# EAGLE design receiver (EAGLE 6.5.0)
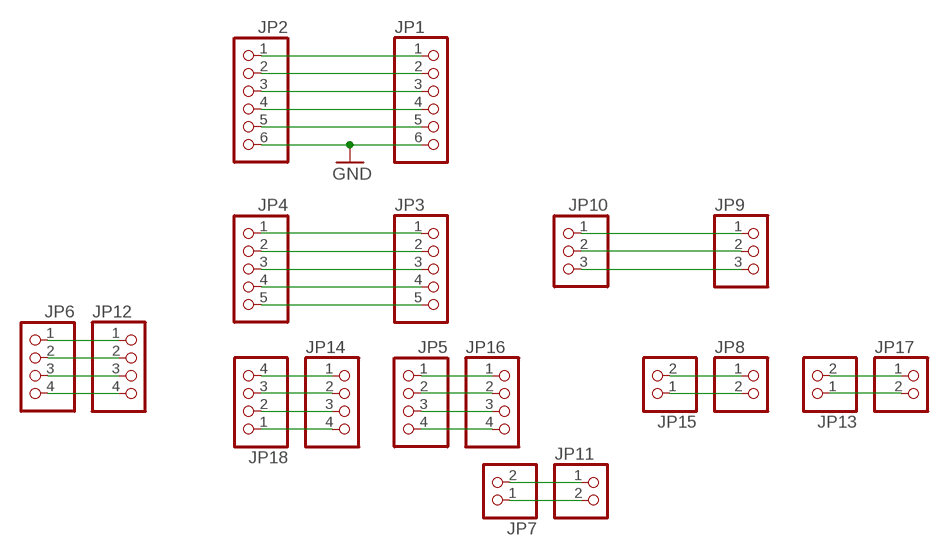
[diagram p0: schematic, sheet 1]

## Parts
JP1  PINHD-1X6  [1X06]
JP2  PINHD-1X6  [1X06]
JP3  PINHD-1X5  [1X05]
JP4  PINHD-1X5  [1X05]
JP5  PINHD-1X4  [1X04]
JP6  PINHD-1X4  [1X04]
JP7  PINHD-1X2  [1X02]
JP8  PINHD-1X2  [1X02]
JP9  PINHD-1X3  [1X03]
JP10  PINHD-1X3  [1X03]
JP11  PINHD-1X2  [1X02]
JP12  PINHD-1X4  [1X04]
JP13  PINHD-1X2  [1X02]
JP14  PINHD-1X4  [1X04]
JP15  PINHD-1X2  [1X02]
JP16  PINHD-1X4  [1X04]
JP17  PINHD-1X2  [1X02]
JP18  PINHD-1X4  [1X04]

## Nets
GND: JP1.6 JP2.6
N$1: JP1.1 JP2.1
N$2: JP1.2 JP2.2
N$3: JP1.3 JP2.3
N$4: JP1.4 JP2.4
N$5: JP1.5 JP2.5
N$6: JP8.1 JP15.2
N$7: JP3.1 JP4.1
N$8: JP3.2 JP4.2
N$9: JP3.3 JP4.3
N$10: JP3.4 JP4.4
N$11: JP3.5 JP4.5
N$12: JP8.2 JP15.1
N$13: JP7.2 JP11.1
N$14: JP7.1 JP11.2
N$15: JP6.1 JP12.1
N$16: JP6.2 JP12.2
N$17: JP6.3 JP12.3
N$18: JP6.4 JP12.4
N$19: JP5.1 JP16.1
N$20: JP9.1 JP10.1
N$21: JP9.2 JP10.2
N$22: JP9.3 JP10.3
N$23: JP5.2 JP16.2
N$24: JP5.3 JP16.3
N$25: JP5.4 JP16.4
N$26: JP14.1 JP18.4
N$27: JP14.2 JP18.3
N$28: JP14.3 JP18.2
N$29: JP14.4 JP18.1
N$30: JP13.2 JP17.1
N$31: JP13.1 JP17.2

## Library data of the parts
JP1 JP2 = pinhead:PINHD-1X6: PIN HEADER
JP3 JP4 = pinhead:PINHD-1X5: PIN HEADER
JP5 JP6 JP12 JP14 JP16 JP18 = pinhead:PINHD-1X4: PIN HEADER
JP7 JP8 JP11 JP13 JP15 JP17 = pinhead:PINHD-1X2: PIN HEADER
JP9 JP10 = pinhead:PINHD-1X3: PIN HEADER

## Board
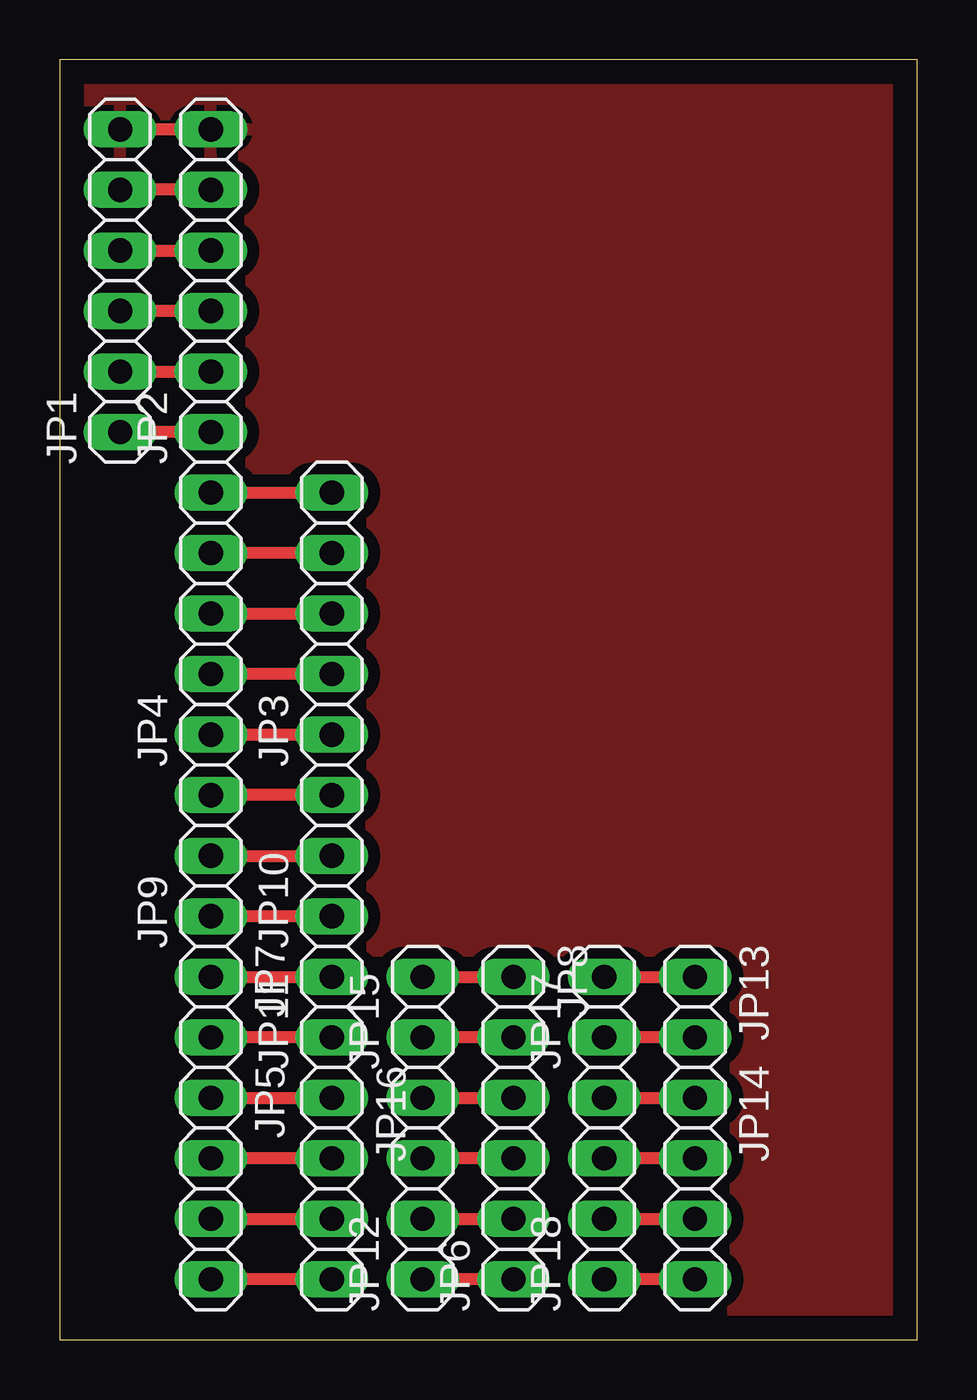
[diagram p1: board, top side]

Size 36 x 53.73 mm. Coordinates in mm from the lower left corner, seen from the top.
Outline: 0,0 36,0 36,53.73 0,53.73 0,0
Copper layers (1*16): Top 0.035mm / dielectric 1.5mm / Bottom 0.035mm
Design rules "default": minimum track width 10mil, minimum drill 24mil, track to track 8mil, track to pad 8mil, pad to pad 8mil, via to via 8mil, smd to smd 8mil, copper to edge 40mil, drill to drill 8mil, minimum pad ring 10mil, minimum via ring 8mil, stop-mask expansion 4mil, vias tented up to drill 0mil, thermal gap 10mil

### Footprints (pad centres in the part's own frame; a part is rotated, then mirrored left to right if it is on the bottom)
1X06 = drill 1.016 long: 1 -6.35,0; 2 -3.81,0; 3 -1.27,0; 4 1.27,0; 5 3.81,0; 6 6.35,0
1X05 = drill 1.016 long: 1 -5.08,0; 2 -2.54,0; 3 0,0; 4 2.54,0; 5 5.08,0
1X04 = drill 1.016 long: 1 -3.81,0; 2 -1.27,0; 3 1.27,0; 4 3.81,0
1X02 = drill 1.016 long: 1 -1.27,0; 2 1.27,0
1X03 = drill 1.016 long: 1 -2.54,0; 2 0,0; 3 2.54,0

### Placement (x,y rotation side)
JP1  2.54,44.45 90 top
JP2  6.35,44.45 90 top
JP3  11.43,30.48 90 top
JP4  6.35,30.48 90 top
JP5  6.35,6.35 270 top
JP6  19.05,6.35 90 top
JP7  6.35,13.97 270 top
JP8  19.05,13.97 270 top
JP9  6.35,20.32 90 top
JP10  11.43,20.32 90 top
JP11  11.43,13.97 90 top
JP12  15.24,6.35 90 top
JP13  26.67,13.97 270 top
JP14  26.67,6.35 270 top
JP15  15.24,13.97 90 top
JP16  11.43,6.35 270 top
JP17  22.86,13.97 90 top
JP18  22.86,6.35 90 top

### Tracks (layer width: path | path; a pad name or v marks a point on that pad's centre or on a via)
GND
  Top 0.508: JP1.6 JP2.6
  pour Top (isolate 0.508): 0,53.34 0,0 36.83,0 36.83,53.34
N$1
  Top 0.508: JP2.1 JP1.1
N$2
  Top 0.508: JP1.2 JP2.2
N$3
  Top 0.508: JP2.3 JP1.3
N$4
  Top 0.508: JP1.4 JP2.4
N$5
  Top 0.508: JP2.5 JP1.5
N$6
  Top 0.508: JP15.2 JP8.1
N$7
  Top 0.508: JP4.1 JP3.1
N$8
  Top 0.508: JP3.2 JP4.2
N$9
  Top 0.508: JP4.3 JP3.3
N$10
  Top 0.508: JP3.4 JP4.4
N$11
  Top 0.508: JP4.5 JP3.5
N$12
  Top 0.508: JP8.2 JP15.1
N$13
  Top 0.508: JP11.1 JP7.2
N$14
  Top 0.508: JP7.1 JP11.2
N$15
  Top 0.508: JP6.1 JP12.1
N$16
  Top 0.508: JP12.2 JP6.2
N$17
  Top 0.508: JP6.3 JP12.3
N$18
  Top 0.508: JP12.4 JP6.4
N$19
  Top 0.508: JP5.1 JP16.1
N$20
  Top 0.508: JP10.1 JP9.1
N$21
  Top 0.508: JP9.2 JP10.2
N$22
  Top 0.508: JP10.3 JP9.3
N$23
  Top 0.508: JP16.2 JP5.2
N$24
  Top 0.508: JP5.3 JP16.3
N$25
  Top 0.508: JP16.4 JP5.4
N$26
  Top 0.508: JP18.4 JP14.1
N$27
  Top 0.508: JP14.2 JP18.3
N$28
  Top 0.508: JP18.2 JP14.3
N$29
  Top 0.508: JP14.4 JP18.1
N$30
  Top 0.508: JP13.2 JP17.1
N$31
  Top 0.508: JP17.2 JP13.1